# Altium schematic sheet Extension_CN.SchDoc: Arduino/Morphos extension connectors
size A4; Author: Ph.A; SheetNumber: 4; SheetTotal: 6
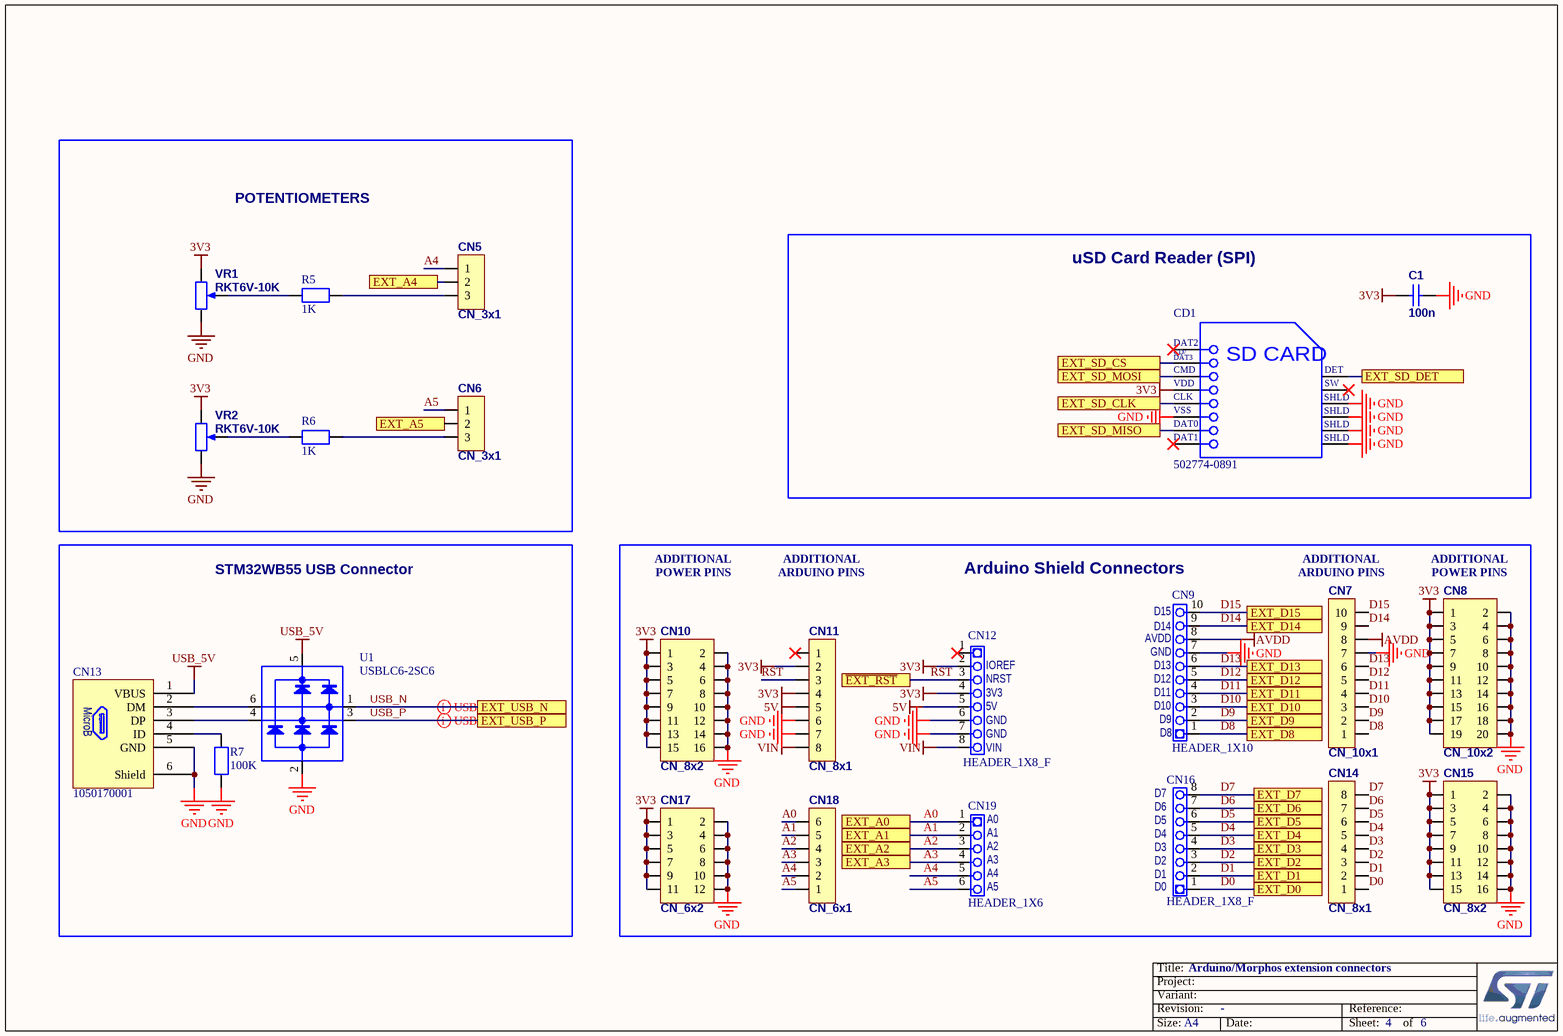
[diagram p0: Extension_CN.SchDoc]

## Parts
C1  100n  [0603_CAP_NPOL]
CD1  502774-0891  [MOLX-502774-0891_V]
CN5  CN_3x1  [GP_3x1_2mm]
CN6  CN_3x1  [GP_3x1_2mm]
CN7  CN_10x1  [GP_10x1]
CN8  CN_10x2  [GP_10x2]
CN9  HEADER_1X10  [Header F 1x10x2.54 TH V]
CN10  CN_8x2  [GP_8x2]
CN11  CN_8x1  [GP_8x1]
CN12  HEADER_1X8_F  [Header F 1x8x2.54 TH V]
CN13  1050170001  [USBMICROB_MOLEX_105017-0001_H2P90]
CN14  CN_8x1  [GP_8x1]
CN15  CN_8x2  [GP_8x2]
CN16  HEADER_1X8_F  [Header F 1x8x2.54 TH V]
CN17  CN_6x2  [GP_6x2]
CN18  CN_6x1  [GP_6x1]
CN19  HEADER_1X6  [Header F 1x6x2.54 TH V]
R5  1K  [0402_RES]
R6  1K  [0402_RES]
R7  100K  [0402_RES]
U1  USBLC6-2SC6  [SOT23-6]
VR1  RKT6V-10K  [PT6LV_2]
VR2  RKT6V-10K  [PT6LV_2]

## Blocks framed on the sheet
POTENTIOMETERS: CN5 CN6 R5 R6 VR1 VR2
uSD Card Reader (SPI): C1 CD1
STM32WB55 USB Connector: CN13 R7 U1
Arduino Shield Connectors: CN7-CN12 CN14-CN19

## Ports
EXT_A0, EXT_A1, EXT_A2, EXT_A3, EXT_A4, EXT_A5, EXT_D0, EXT_D1, EXT_D2, EXT_D3, EXT_D4, EXT_D5, EXT_D6, EXT_D7, EXT_D8, EXT_D9, EXT_D10, EXT_D11, EXT_D12, EXT_D13, EXT_D14, EXT_D15, EXT_SD_CLK, EXT_SD_CS, EXT_SD_DET, EXT_SD_MISO, EXT_SD_MOSI, EXT_USB_N, EXT_USB_P, ~{EXT_RST}

## Nets
3V3: C1.1 CD1.4(VDD) CN8.1 CN8.3 CN8.5 CN8.7 CN8.9 CN8.11 CN8.13 CN8.15 CN8.17 CN8.19 CN10.1 CN10.3 CN10.5 CN10.7 CN10.9 CN10.11 CN10.13 CN10.15 CN11.2 CN11.4 CN12.2 CN12.4 CN15.1 CN15.3 CN15.5 CN15.7 CN15.9 CN15.11 CN15.13 CN15.15 CN17.1 CN17.3 CN17.5 CN17.7 CN17.9 CN17.11 VR1.2(BOT) VR2.2(BOT)
5V: CN11.5 CN12.5
AVDD: CN7.8 CN9.8
GND: C1.2 CD1.6(VSS) CD1.11(SHLD) CD1.12(SHLD) CD1.13(SHLD) CD1.14(SHLD) CN7.7 CN8.2 CN8.4 CN8.6 CN8.8 CN8.10 CN8.12 CN8.14 CN8.16 CN8.18 CN8.20 CN9.7 CN10.2 CN10.4 CN10.6 CN10.8 CN10.10 CN10.12 CN10.14 CN10.16 CN11.6 CN11.7 CN12.6 CN12.7 CN13.5(GND) CN13.6(Shield) CN15.2 CN15.4 CN15.6 CN15.8 CN15.10 CN15.12 CN15.14 CN15.16 CN17.2 CN17.4 CN17.6 CN17.8 CN17.10 CN17.12 R7.1 U1.2 VR1.1(TOP) VR2.1(TOP)
USB_5V: CN13.1(VBUS) U1.5
VIN: CN11.8 CN12.8
A0: CN18.6 CN19.1 ; port EXT_A0
A1: CN18.5 CN19.2 ; port EXT_A1
A2: CN18.4 CN19.3 ; port EXT_A2
A3: CN18.3 CN19.4 ; port EXT_A3
A4: CN5.1 CN18.2 CN19.5
A5: CN6.1 CN18.1 CN19.6
D0: CN14.1 CN16.1 ; port EXT_D0
D1: CN14.2 CN16.2 ; port EXT_D1
D2: CN14.3 CN16.3 ; port EXT_D2
D3: CN14.4 CN16.4 ; port EXT_D3
D4: CN14.5 CN16.5 ; port EXT_D4
D5: CN14.6 CN16.6 ; port EXT_D5
D6: CN14.7 CN16.7 ; port EXT_D6
D7: CN14.8 CN16.8 ; port EXT_D7
D8: CN7.1 CN9.1 ; port EXT_D8
D9: CN7.2 CN9.2 ; port EXT_D9
D10: CN7.3 CN9.3 ; port EXT_D10
D11: CN7.4 CN9.4 ; port EXT_D11
D12: CN7.5 CN9.5 ; port EXT_D12
D13: CN7.6 CN9.6 ; port EXT_D13
D14: CN7.9 CN9.9 ; port EXT_D14
D15: CN7.10 CN9.10 ; port EXT_D15
EXT_A4: CN5.2 ; port EXT_A4
EXT_A5: CN6.2 ; port EXT_A5
EXT_SD_CLK: CD1.5(CLK) ; port EXT_SD_CLK
EXT_SD_CS: CD1.2(CD/DAT3) ; port EXT_SD_CS
EXT_SD_DET: CD1.9(DETECT) ; port EXT_SD_DET
EXT_SD_MISO: CD1.7(DAT0) ; port EXT_SD_MISO
EXT_SD_MOSI: CD1.3(CMD) ; port EXT_SD_MOSI
RST: CN11.3 CN12.3 ; port ~{EXT_RST}
USB_N: U1.1 ; port EXT_USB_N
USB_P: U1.3 ; port EXT_USB_P
NetCN5_3: CN5.3 R5.2
NetCN6_3: CN6.3 R6.2
NetCN13_2: CN13.2(DM) U1.6
NetCN13_3: CN13.3(DP) U1.4
NetCN13_4: CN13.4(ID) R7.2
NetR5_1: R5.1 VR1.3(TAP)
NetR6_1: R6.1 VR2.3(TAP)

Not connected (* = marked no-connect by the designer): CD1 1(DAT2)* 8(DAT1)* 10(SWITCH)*; CN11 1*; CN12 1*

## Layout directives
differential pair; net class DIFF90: USB_N, USB_P

## Notes on the sheet
- ADDITIONAL
- POWER PINS
- ARDUINO PINS
- (near CN7) ADDITIONAL
- (near CN7) ARDUINO PINS
- (near CN8) ADDITIONAL
- (near CN8) POWER PINS
- (near CN9) AVDD
- (near CN9) GND
- (near CN9) D14
- (near CN9) D15
- (near CN12) 5V
- (near CN12) 3V3
- (near CN12) NRST
- (near CN12) IOREF
- (near CN9) D10
- (near CN9) D11
- (near CN9) D12
- (near CN9) D13
- (near CN12) GND
- (near CN12) VIN
- (near CN9) D9
- (near CN9) D8
- (near CN19) A0
- (near CN19) A1
- (near CN19) A2
- (near CN16) D3
- (near CN16) D4
- (near CN16) D5
- (near CN16) D6
- (near CN16) D7
- (near CN19) A5
- (near CN19) A3
- (near CN19) A4
- (near CN16) D0
- (near CN16) D1
- (near CN16) D2
- Title:
- Project:
- Size:
- Revision:
- Variant:
- -
- Date:
- Reference:
- Sheet:
- of
- (in symbol 1050170001) MicroB
- (in symbol CMP-2000-05248-1) CD/; DAT3; SD CARD; DET; SW

## Library data of the parts
C1 = Cap: Capacitor; ComponentLink1Description: datasheet; ComponentLink2Description: supplier; Value: 100n
CD1 = CMP-2000-05248-1: Micro SD Memory Card Connector, 0.5 A, 10 V (DC), -25 to 85 degC, 8-Pin SMT, RoHS, Tape and Reel; Manufacturer: Molex; 3D Model: 502774-0891.stp; Online Catalog: microSD™Series; Number of Positions: 10(8+2); Card Type: SecureDigital-microSD™; Insertion, Removal Method: PushIn,PushOut; Other Names: WM24066DKR; Connector Type: ConnectorandEjector; Features: Switch; Family: MemoryConnectors-PCCardSockets; Manufacturer URL: http://www.molex.com/; Mounting Type: SurfaceMount,RightAngle; Contact Finish Thickness: 20µin(0.51µm); Standard Package: 1; Series: 502774; Ejector Side: -; Datasheet Version: Rev. D, 04/2004; Category: Connectors,Interconnects; Contact Finish: Gold; Datasheet URL: https://datasheet.ciiva.com/1104/1499551-1104671.pdf; RoHS Information: 502774-0891CertofCompliance; Mounting Feature: Reverse-Bottom; Packaging: Digi-Reel; Height Above Board: 0.071"(1.80mm); Catalog Drawings: 502774-0891
CN12 = HEADER_1X8: Specific Function: Arduino Power
CN13 = 1050170001: USB-MICRO-B, 1050170001, SMT, MOLEX; Fitted: YES; Ordered_By: Subcon; ECCN_US/EU: n/a; Manuf_1: MOLEX; Manuf_Part_1: 1050170001; Distrib: DIGIKEY; Value: 1050170001; Order_Code: *
CN16 = HEADER_1X8: Specific Function: Arduino Digital 1
R5-R7 = RES: Resistor
U1 = USBLC6-2
VR1 VR2 = RKT6V-10K: Potentiometer: mounting; single turn, horizontal; 10kΩ; 100mW; Published: 21-10-2009; ComponentLink1Description: datasheet; ComponentLink2Description: supplier; Supplier 1: TME; Supplier Part Number 1: RKT6V-10K